# Altium project ModularPwrConv.PrjPcb
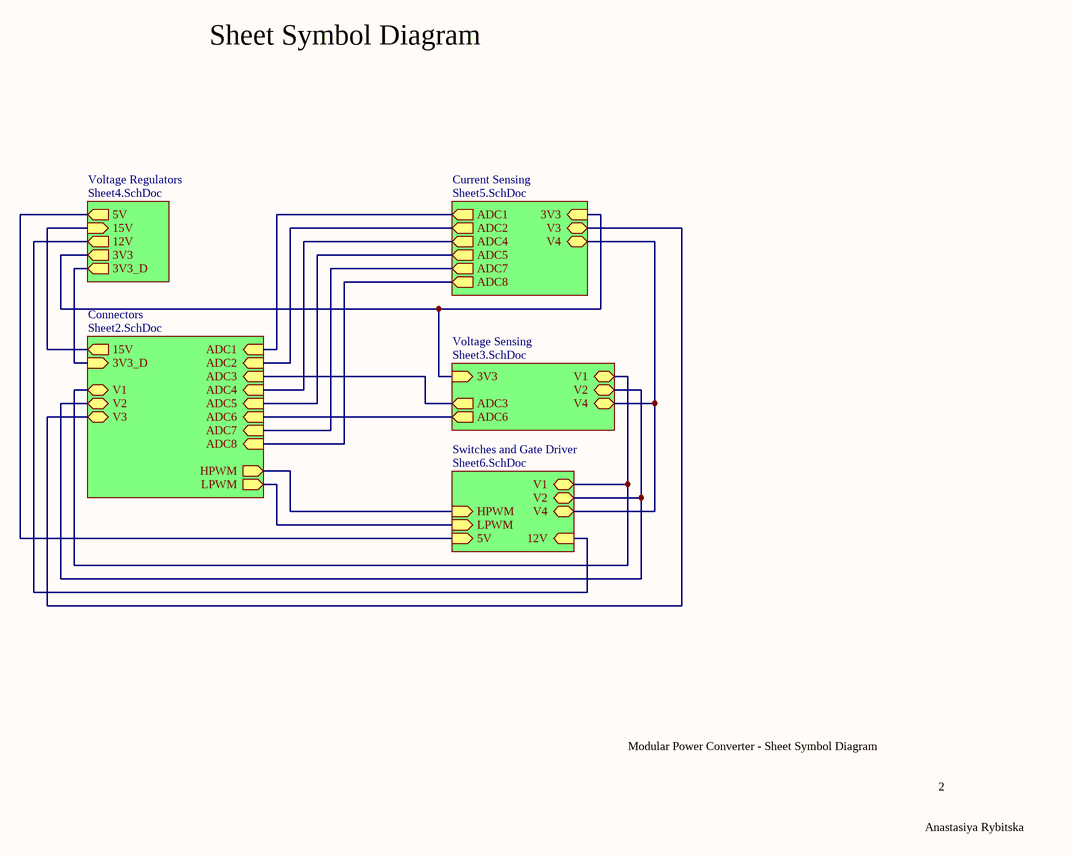
[diagram p0: Sheet1.SchDoc]
6 sheets, 147 parts. Net scope: hierarchical (ports join the sheet entries above them; power ports are global).
Board file: PCB1.PcbDoc
Sheets:
  Sheet1.SchDoc
    Connectors = Sheet2.SchDoc
    Voltage Sensing = Sheet3.SchDoc
    Voltage Regulators = Sheet4.SchDoc
    Current Sensing = Sheet5.SchDoc
    Switches and Gate Driver = Sheet6.SchDoc

## Sheet Sheet1.SchDoc
size A4; SheetNumber: 1; SheetTotal: 6

### Sub-sheets
Connectors = Sheet2.SchDoc: V1 (bidir), V2 (bidir), V3 (bidir), 15V (out), 3V3_D (in), ADC1 (in), ADC2 (in), ADC3 (in), ADC4 (in), ADC5 (in), ADC6 (in), ADC7 (in), ADC8 (in), HPWM (out), LPWM (out)
Current Sensing = Sheet5.SchDoc: V4 (bidir), V3 (bidir), ADC8 (out), ADC7 (out), ADC5 (out), ADC4 (out), ADC2 (out), ADC1 (out), 3V3 (in)
Switches and Gate Driver = Sheet6.SchDoc: V4 (bidir), V2 (bidir), 12V (in), HPWM (in), LPWM (in), V1 (bidir), 5V (in)
Voltage Regulators = Sheet4.SchDoc: 15V (in), 12V (out), 3V3 (out), 3V3_D (out), 5V (out)
Voltage Sensing = Sheet3.SchDoc: 3V3 (in), ADC3 (out), ADC6 (out), V1 (bidir), V2 (bidir), V4 (bidir)

### Nets
3V3: sheet Voltage Sensing/3V3, sheet Voltage Regulators/3V3, sheet Current Sensing/3V3
3V3_D: sheet Connectors/3V3_D, sheet Voltage Regulators/3V3_D
5V: sheet Voltage Regulators/5V, sheet Switches and Gate Driver/5V
12V: sheet Voltage Regulators/12V, sheet Switches and Gate Driver/12V
15V: sheet Connectors/15V, sheet Voltage Regulators/15V
ADC1: sheet Connectors/ADC1, sheet Current Sensing/ADC1
ADC2: sheet Connectors/ADC2, sheet Current Sensing/ADC2
ADC3: sheet Connectors/ADC3, sheet Voltage Sensing/ADC3
ADC4: sheet Connectors/ADC4, sheet Current Sensing/ADC4
ADC5: sheet Connectors/ADC5, sheet Current Sensing/ADC5
ADC6: sheet Connectors/ADC6, sheet Voltage Sensing/ADC6
ADC7: sheet Connectors/ADC7, sheet Current Sensing/ADC7
ADC8: sheet Connectors/ADC8, sheet Current Sensing/ADC8
HPWM: sheet Connectors/HPWM, sheet Switches and Gate Driver/HPWM
LPWM: sheet Connectors/LPWM, sheet Switches and Gate Driver/LPWM
V1: sheet Connectors/V1, sheet Voltage Sensing/V1, sheet Switches and Gate Driver/V1
V2: sheet Connectors/V2, sheet Voltage Sensing/V2, sheet Switches and Gate Driver/V2
V3: sheet Connectors/V3, sheet Current Sensing/V3
V4: sheet Voltage Sensing/V4, sheet Current Sensing/V4, sheet Switches and Gate Driver/V4

### Notes on the sheet
- Sheet Symbol Diagram
- Modular Power Converter - Sheet Symbol Diagram
- 2
- Anastasiya Rybitska

## Sheet Sheet2.SchDoc
size A4; SheetNumber: 2; SheetTotal: 6
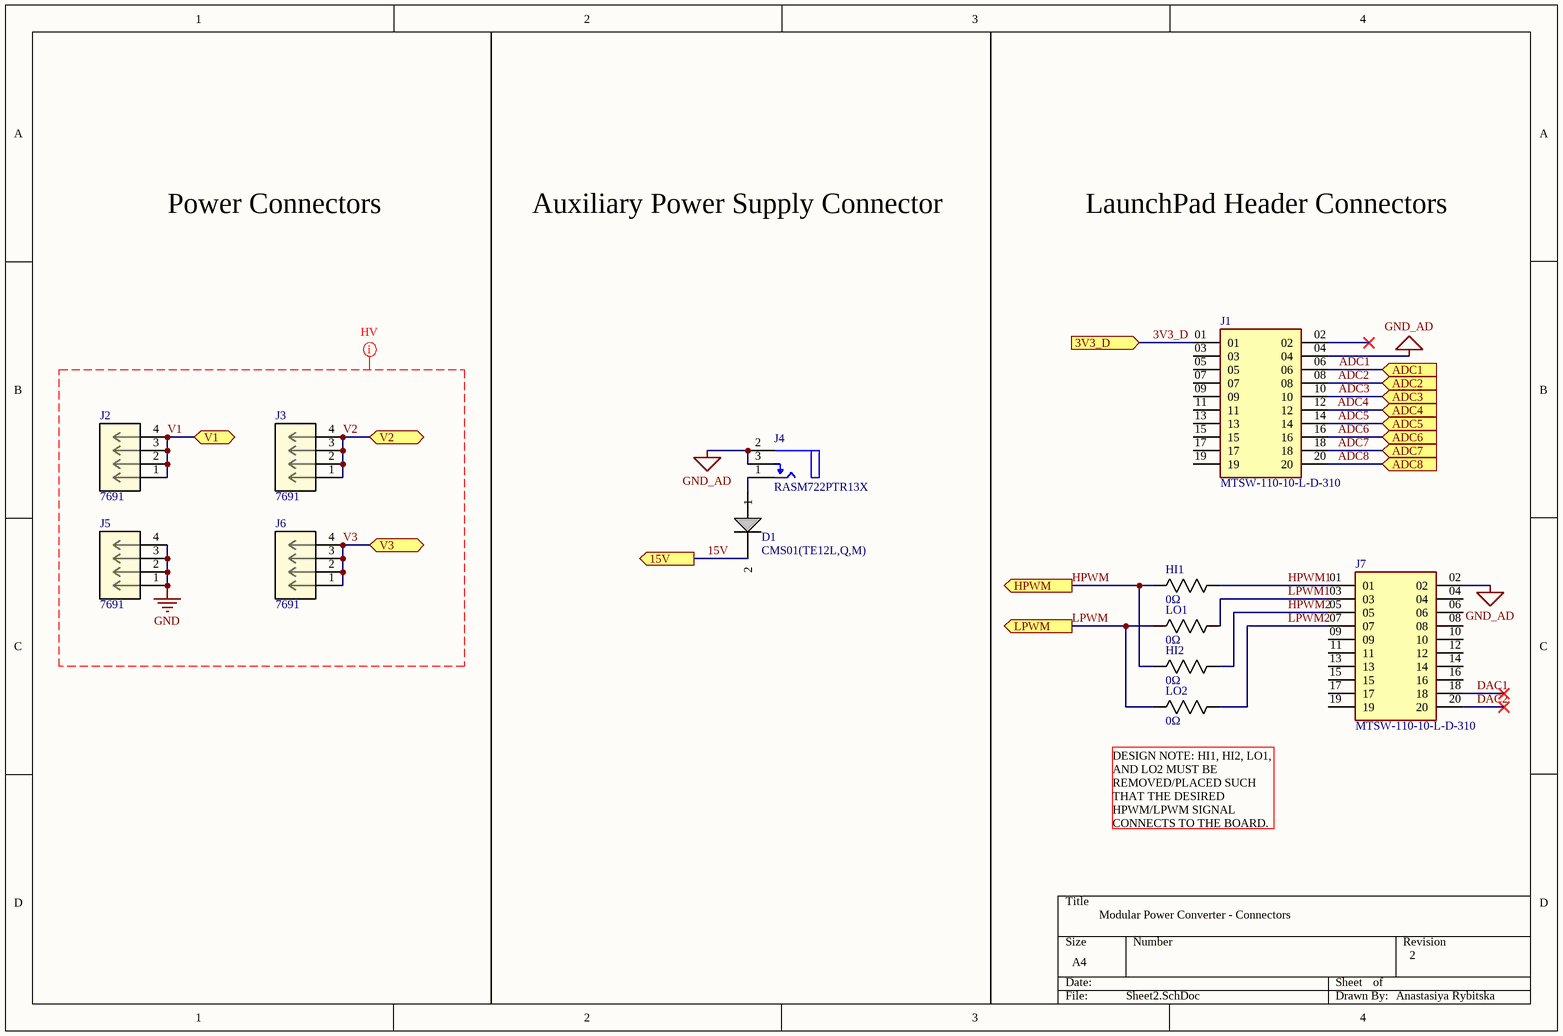
[diagram p1: Sheet2.SchDoc]

### Parts
D1  CMS01(TE12L,Q,M)  [M-FLAT_TOS]
HI1  Resistance: 0Ω  [0603]  (hidden comment: AC0603FR-070RL)
HI2  Resistance: 0Ω  [0603]  (hidden comment: AC0603FR-070RL)
J1  MTSW-110-10-L-D-310  [SAMTEC_MTSW-110-10-L-D-310]
J2  7691  [CONN_8191_KEY]
J3  7691  [CONN_8191_KEY]
J4  RASM722PTR13X  [FP-RASM722PTR13X-MFG]
J5  7691  [CONN_8191_KEY]
J6  7691  [CONN_8191_KEY]
J7  MTSW-110-10-L-D-310  [SAMTEC_MTSW-110-10-L-D-310]
LO1  Resistance: 0Ω  [0603]  (hidden comment: AC0603FR-070RL)
LO2  Resistance: 0Ω  [0603]  (hidden comment: AC0603FR-070RL)

### Ports
3V3_D (in), 15V (out), ADC1 (in), ADC2 (in), ADC3 (in), ADC4 (in), ADC5 (in), ADC6 (in), ADC7 (in), ADC8 (in), HPWM (out), LPWM (out), V1 (bidir), V2 (bidir), V3 (bidir)

### Nets
GND: J5.1 J5.2 J5.3 J5.4
GND_AD: J1.04 J4.2(SLEEVE_TERMINAL) J4.3(SHUNT_TERMINAL) J7.02
3V3_D: J1.01 ; port 3V3_D
15V: D1.2 ; port 15V
ADC1: J1.06 ; port ADC1
ADC2: J1.08 ; port ADC2
ADC3: J1.10 ; port ADC3
ADC4: J1.12 ; port ADC4
ADC5: J1.14 ; port ADC5
ADC6: J1.16 ; port ADC6
ADC7: J1.18 ; port ADC7
ADC8: J1.20 ; port ADC8
DAC1: J7.18
DAC2: J7.20
HPWM: HI1.1 HI2.1 ; port HPWM
HPWM1: HI1.2 J7.01
HPWM2: HI2.2 J7.05
LPWM: LO1.1 LO2.1 ; port LPWM
LPWM1: J7.03 LO1.2
LPWM2: J7.07 LO2.2
V1: J2.1 J2.2 J2.3 J2.4 ; port V1
V2: J3.1 J3.2 J3.3 J3.4 ; port V2
V3: J6.1 J6.2 J6.3 J6.4 ; port V3
NetD1_1: D1.1 J4.1(TIP_TERMINAL(CENTER_PIN))

Not connected (* = marked no-connect by the designer): J1 02* 03 05 07 09 11 13 15 17 19; J7 04 06 08 09 10 11 12 13 14 15 16 17 19

### Layout directives
rule Clearance Constraint [Clearance = 0.6mm]: GND, V1, V2, V3

### Notes on the sheet
- Power Connectors
- Auxiliary Power Supply Connector
- LaunchPad Header Connectors
- (near LO2) DESIGN NOTE: HI1, HI2, LO1, AND LO2 MUST BE REMOVED/PLACED SUCH THAT THE DESIRED HPWM/LPWM SIGNAL CONNECTS TO THE BOARD.
- Modular Power Converter - Connectors
- 2
- Anastasiya Rybitska

### Library data of the parts
D1 = CMS01(TE12L,Q,M): No Description Available; Mfr_Name: Toshiba Electronic Devices & Storage Co.; Type: DEV; Number_devices_in_Package: 1; Copyright: Copyright (C) 2022 Ultra Librarian. All rights reserved.; Manufacturer_Part_Number: CMS01(TE12L,Q,M); Digi-Key_Part_Number_1: CMS01QTR-ND; Digi-Key_Part_Number_2: CMS01QCT-ND; Digi-Key_Part_Number_3: CMS01QDKR-ND; RefDes: RefDes; Source_Package: CMS01
HI1 HI2 LO1 LO2 = AC0603FR-070RL: RES SMD 0 OHM JUMPER 1/10W 0603
J2 J3 J5 J6 = 7691: TERM SCREW 6-32 4 PIN PCB; Mfr_Name: Keystone Electronics; Copyright: Copyright (C) 2022 Ultra Librarian. All rights reserved.; Manufacturer_Part_Number: 7691; Digi-Key_Part_Number_1: 36-8191-ND; Digi-Key_Part_Number_2: 8191K-ND; Digi-Key_Part_Number_3: 36-8191-NDL; RefDes: RefDes; Type: DEV
J4 = CMP-47995-000002-1: CONN PWR JACK 2.1X5.5MM SOLDER; Shielding: Unshielded; Gender: Male; Current Rating: 5A; Termination: Solder; Contact Material: Copper Alloy; Package Quantity: 120; Case/Package: SMD/SMT; Contact Plating: Tin; Connector Type: Jack; Housing Material: Thermoplastic; Mount: Surface Mount; Housing Color: Black; Color: Black
J1 J7 = MTSW-110-10-L-D-310: Package: None; Price: None; Value: *; MP: MTSW-110-10-L-D-310; Availability: Unavailable

## Sheet Sheet3.SchDoc
size A4; SheetNumber: 3; SheetTotal: 6
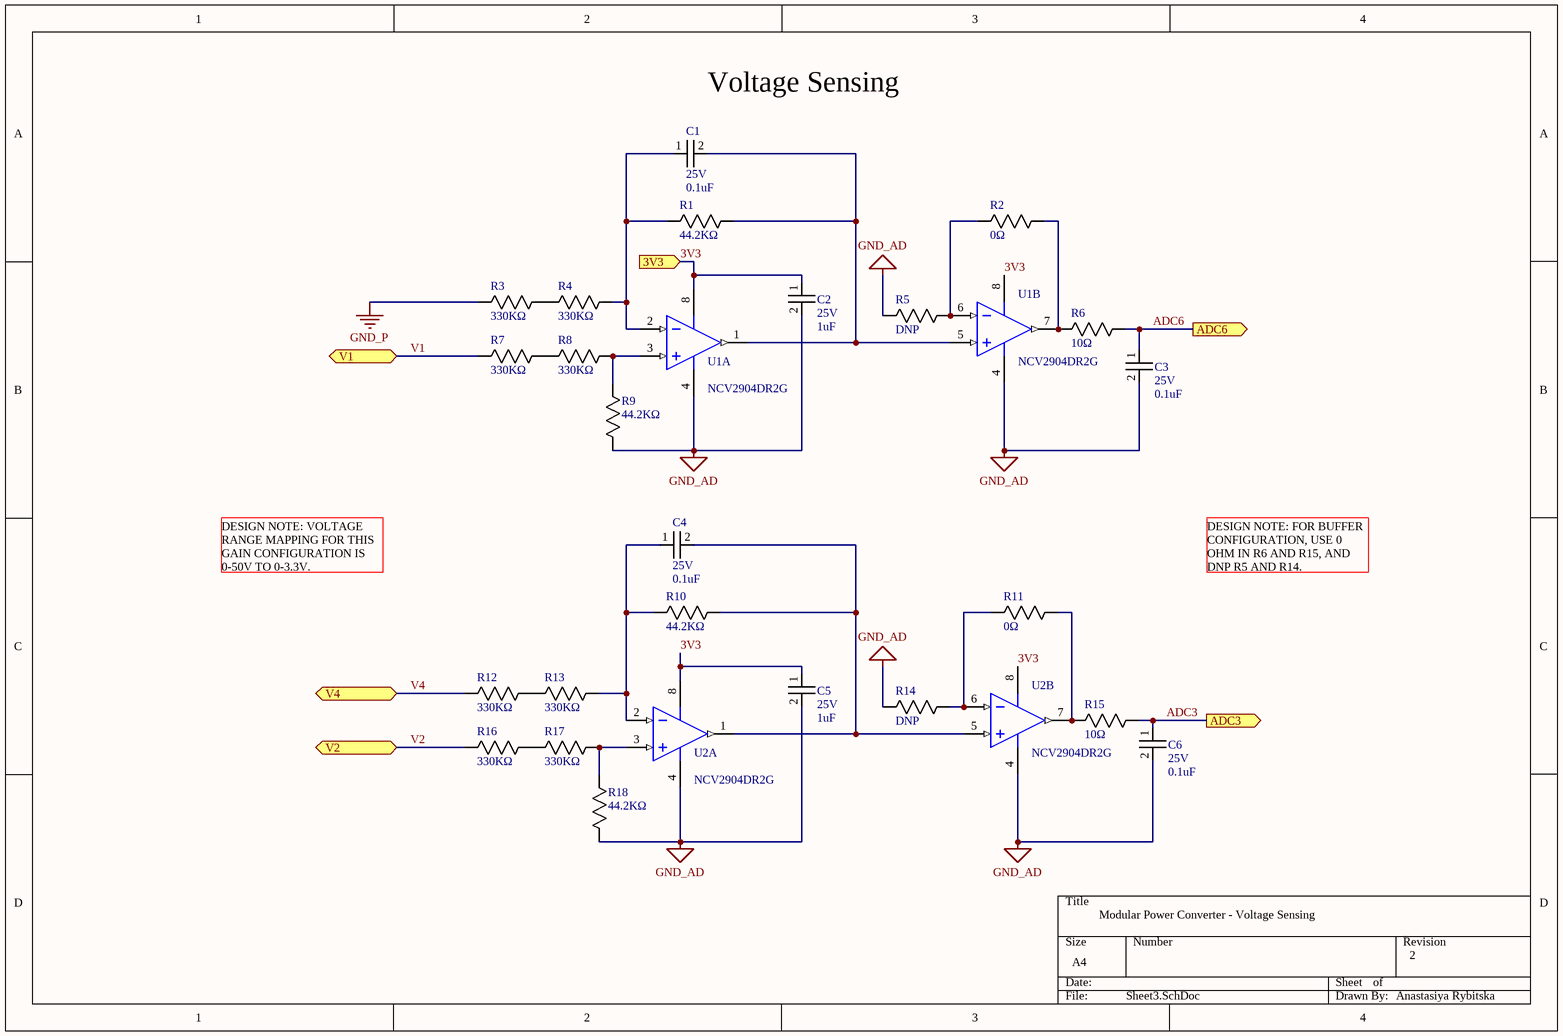
[diagram p2: Sheet3.SchDoc]

### Parts
C1  Voltage Rating: 25V  Capacitance: 0.1uF  [0603]  (hidden comment: CC0603MRX7R8BB104)
C2  Voltage Rating: 25V  Capacitance: 1uF  [0603]  (hidden comment: CL10B105KA8NFNC)
C3  Voltage Rating: 25V  Capacitance: 0.1uF  [0603]  (hidden comment: CC0603MRX7R8BB104)
C4  Voltage Rating: 25V  Capacitance: 0.1uF  [0603]  (hidden comment: CC0603MRX7R8BB104)
C5  Voltage Rating: 25V  Capacitance: 1uF  [0603]  (hidden comment: CL10B105KA8NFNC)
C6  Voltage Rating: 25V  Capacitance: 0.1uF  [0603]  (hidden comment: CC0603MRX7R8BB104)
R1  Resistance: 44.2KΩ  [0603]  (hidden comment: RT0603FRE0744K2L)
R2  Resistance: 0Ω  [0603]  (hidden comment: AC0603FR-070RL)
R3  Resistance: 330KΩ  [0603]  (hidden comment: ERJ3EKF3303V)
R4  Resistance: 330KΩ  [0603]  (hidden comment: ERJ3EKF3303V)
R5  Resistance: DNP  [0603]  (hidden comment: AC0603FR-070RL)
R6  Resistance: 10Ω  [0603]  (hidden comment: RMCF0603JT10R0)
R7  Resistance: 330KΩ  [0603]  (hidden comment: ERJ3EKF3303V)
R8  Resistance: 330KΩ  [0603]  (hidden comment: ERJ3EKF3303V)
R9  Resistance: 44.2KΩ  [0603]  (hidden comment: RT0603FRE0744K2L)
R10  Resistance: 44.2KΩ  [0603]  (hidden comment: RT0603FRE0744K2L)
R11  Resistance: 0Ω  [0603]  (hidden comment: AC0603FR-070RL)
R12  Resistance: 330KΩ  [0603]  (hidden comment: ERJ3EKF3303V)
R13  Resistance: 330KΩ  [0603]  (hidden comment: ERJ3EKF3303V)
R14  Resistance: DNP  [0603]  (hidden comment: AC0603FR-070RL)
R15  Resistance: 10Ω  [0603]  (hidden comment: RMCF0603JT10R0)
R16  Resistance: 330KΩ  [0603]  (hidden comment: ERJ3EKF3303V)
R17  Resistance: 330KΩ  [0603]  (hidden comment: ERJ3EKF3303V)
R18  Resistance: 44.2KΩ  [0603]  (hidden comment: RT0603FRE0744K2L)
U1  NCV2904DR2G  [ONSC-SOIC-8-751-07_V]  (parts A,B of 2)
U2  NCV2904DR2G  [ONSC-SOIC-8-751-07_V]  (parts A,B of 2)

### Ports
3V3 (in), ADC3 (out), ADC6 (out), V1 (bidir), V2 (bidir), V4 (bidir)

### Nets
GND_AD: C2.2 C3.2 C5.2 C6.2 R5.1 R9.1 R14.1 R18.1 U1.4(VEE/GND) U2.4(VEE/GND)
GND_P: R3.1
3V3: C2.1 C5.1 U1.8(VCC) U2.8(VCC) ; port 3V3
ADC3: C6.1 R15.2 ; port ADC3
ADC6: C3.1 R6.2 ; port ADC6
V1: R7.1 ; port V1
V2: R16.1 ; port V2
V4: R12.1 ; port V4
NetC1_1: C1.1 R1.1 R4.2 U1.2(INA-)
NetC1_2: C1.2 R1.2 U1.1(OUTA) U1.5(INB+)
NetC4_1: C4.1 R10.1 R13.2 U2.2(INA-)
NetC4_2: C4.2 R10.2 U2.1(OUTA) U2.5(INB+)
NetR2_1: R2.1 R5.2 U1.6(INB-)
NetR2_2: R2.2 R6.1 U1.7(OUTB)
NetR3_2: R3.2 R4.1
NetR7_2: R7.2 R8.1
NetR8_2: R8.2 R9.2 U1.3(INA+)
NetR11_1: R11.1 R14.2 U2.6(INB-)
NetR11_2: R11.2 R15.1 U2.7(OUTB)
NetR12_2: R12.2 R13.1
NetR16_2: R16.2 R17.1
NetR17_2: R17.2 R18.2 U2.3(INA+)

### Notes on the sheet
- Voltage Sensing
- DESIGN NOTE: VOLTAGE RANGE MAPPING FOR THIS GAIN CONFIGURATION IS 0-50V TO 0-3.3V.
- DESIGN NOTE: FOR BUFFER CONFIGURATION, USE 0 OHM IN R6 AND R15, AND DNP R5 AND R14.
- Modular Power Converter - Voltage Sensing
- 2
- Anastasiya Rybitska

### Library data of the parts
C1 C3 C4 C6 = CC0603MRX7R8BB104: CAP CER 0.1UF 25V X7R 0603
C2 C5 = CL10B105KA8NFNC: Cap Ceramic 1uF 25V X7R ±10% Pad SMD 0603 +125°C T/R
R1 R9 R10 R18 = RT0603FRE0744K2L: RES SMD 44.2K OHM 1% 1/10W 0603
R2 R5 R11 R14 = AC0603FR-070RL: RES SMD 0 OHM JUMPER 1/10W 0603
R6 R15 = RMCF0603JT10R0: RES 10 OHM 5% 1/10W 0603
U1 U2 = CMP-1310-00228-1: Single Supply Dual Operational Amplifier, 3 to 32 V, -40 to 125 degC, 8-Pin SOIC, Pb-Free, Tape and Reel; Manufacturer: On Semiconductor; VCC Min (V): 3; VCC Max (V): 32; DatasheetVersion: Rev. 27; ComponentLink2URL: http://www.onsemi.cn/pub_link/Collateral/LM358-D.PDF; Mounting Technology: Surface Mount; PackageReference: SOIC-8-751-07; PartNumber: NCV2904DR2G; ComponentLink1Description: Manufacturer URL; ComponentLink2Description: Datasheet; ComponentLink3Description: Package Specification; RoHS: TRUE; PackageDescription: 8-Pin Small Outline Integrated Circuit, Body 4.9 x 3.9 mm, Pitch 1.27 mm; ComponentLink3URL: http://www.onsemi.com/pub_link/Collateral/751-07.PDF; PackageVersion: Rev. AK, 02/2011; ComponentLink1URL: http://www.onsemi.com/; Packing: Tape and Reel

## Sheet Sheet4.SchDoc
size A4; SheetNumber: 4; SheetTotal: 6
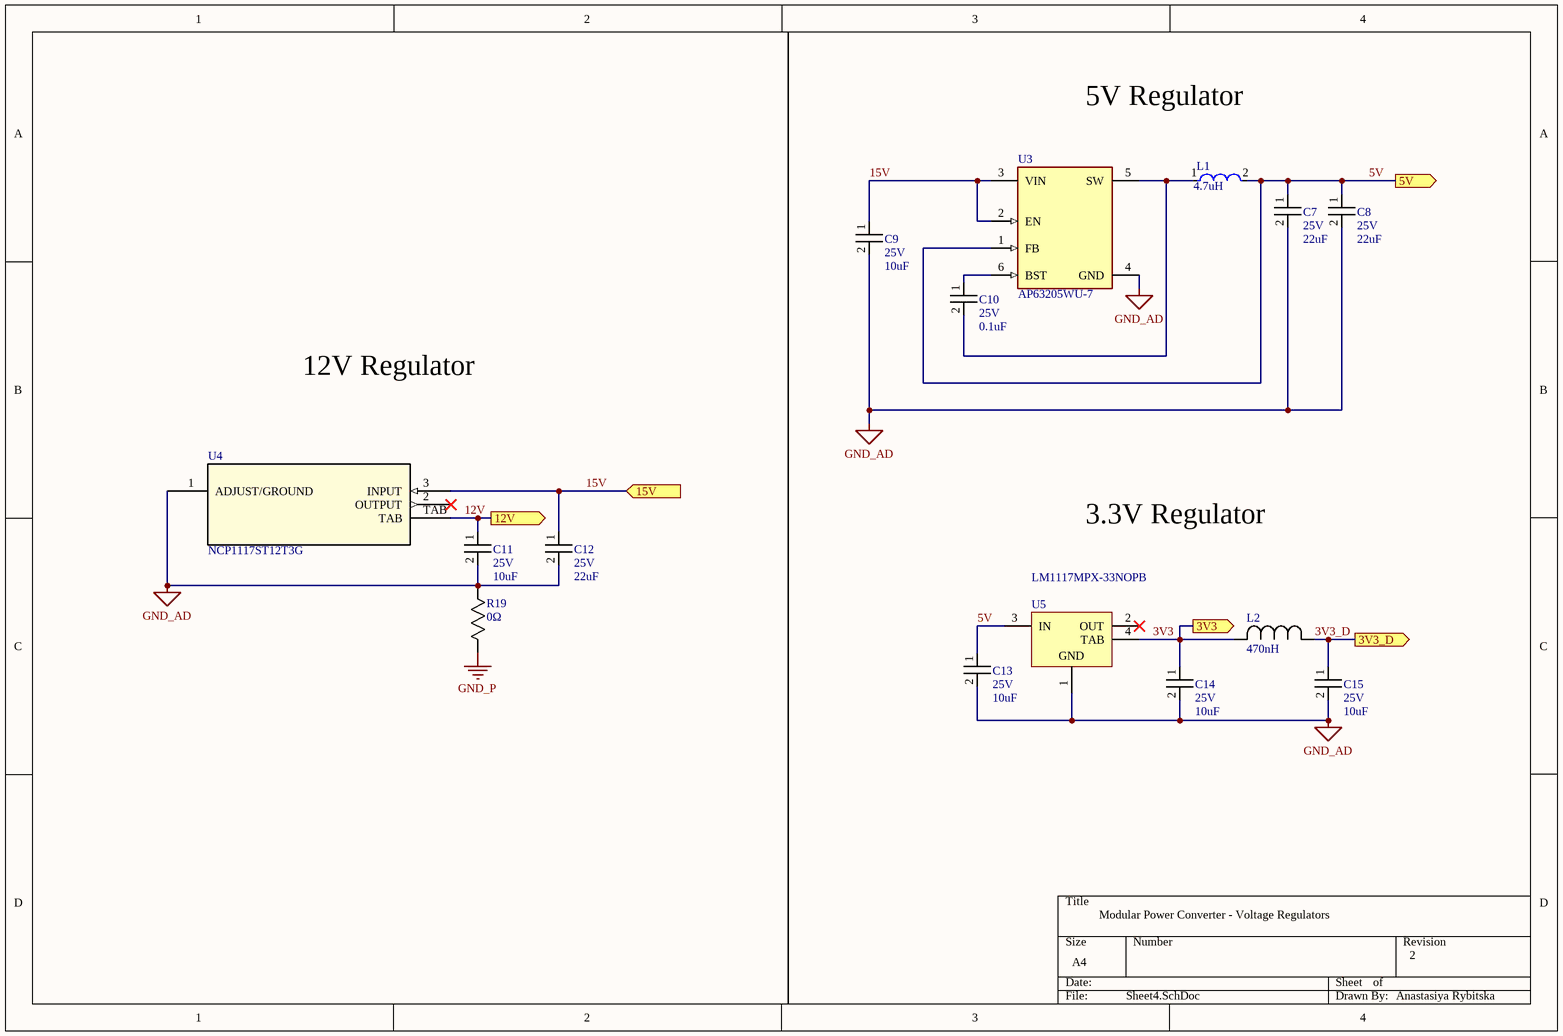
[diagram p3: Sheet4.SchDoc]

### Parts
C7  Voltage Rating: 25V  Capacitance: 22uF  [0805]  (hidden comment: CL21A226MAYNNNE)
C8  Voltage Rating: 25V  Capacitance: 22uF  [0805]  (hidden comment: CL21A226MAYNNNE)
C9  Voltage Rating: 25V  Capacitance: 10uF  [0805]  (hidden comment: TMK212BBJ106KG-T)
C10  Voltage Rating: 25V  Capacitance: 0.1uF  [0603]  (hidden comment: CC0603MRX7R8BB104)
C11  Voltage Rating: 25V  Capacitance: 10uF  [0805]  (hidden comment: TMK212BBJ106KG-T)
C12  Voltage Rating: 25V  Capacitance: 22uF  [0805]  (hidden comment: CL21A226MAYNNNE)
C13  Voltage Rating: 25V  Capacitance: 10uF  [0805]  (hidden comment: TMK212BBJ106KG-T)
C14  Voltage Rating: 25V  Capacitance: 10uF  [0805]  (hidden comment: TMK212BBJ106KG-T)
C15  Voltage Rating: 25V  Capacitance: 10uF  [0805]  (hidden comment: TMK212BBJ106KG-T)
L1  Inductance: 4.7uH  [FP-MLZ2012-0_85-IPC_B]  (hidden comment: MLZ2012M4R7WT000)
L2  Inductance: 470nH  [0805]  (hidden comment: MLZ2012DR47DT000)
R19  Resistance: 0Ω  [0603]  (hidden comment: AC0603FR-070RL)
U3  AP63205WU-7  [FP-TSOT26-MFG]
U4  NCP1117ST12T3G  [SOT223-3_ONS]
U5  LM1117MPX-33NOPB  [DCY0004A_L]

### Ports
3V3 (out), 3V3_D (out), 5V (out), 12V (out), 15V (in)

### Nets
GND_AD: C7.2 C8.2 C9.2 C11.2 C12.2 C13.2 C14.2 C15.2 R19.1 U3.4(GND) U4.1(ADJUST/GROUND) U5.1(GND)
GND_P: R19.2
3V3: C14.1 L2.2 U5.4(TAB) ; port 3V3
3V3_D: C15.1 L2.1 ; port 3V3_D
5V: C7.1 C8.1 C13.1 L1.2 U3.1(FB) U5.3(IN) ; port 5V
12V: C11.1 U4.TAB ; port 12V
15V: C9.1 C12.1 U3.2(EN) U3.3(VIN) U4.3(INPUT) ; port 15V
NetC10_1: C10.1 U3.6(BST)
NetC10_2: C10.2 L1.1 U3.5(SW)

Not connected (* = marked no-connect by the designer): U4 2(OUTPUT)*; U5 2(OUT)*

### Notes on the sheet
- 5V Regulator
- 12V Regulator
- 3.3V Regulator
- Modular Power Converter - Voltage Regulators
- 2
- Anastasiya Rybitska

### Library data of the parts
C7 C8 C12 = TMK212BBJ106KG-T: 22 µF ±20% 25V Ceramic Capacitor X5R 0805 (2012 Metric)
C9 C11 C13-C15 = TMK212BBJ106KG-T: Multilayer Ceramic Capacitor 10uF 25V X5R 10% SMD 0805 T/R
C10 = CC0603MRX7R8BB104: CAP CER 0.1UF 25V X7R 0603
L1 = CMP-08253-000349-1: Shielded Multilayer Inductor 4.7uH ±20% 500mA 390mΩ SMD 0805; Self Resonant Frequency: 70MHz; Saturation Current: 180mA; Test Frequency: 2MHz; Core Material: Ferrite; DC Resistance (DCR): 390mR; Current Rating: 500mA; Length: 0.079inch; Case Code (Imperial): 0805; Mount: Surface Mount; Max Operating Temperature: 125°C; RoHS Compliant: Yes; Case Code (Metric): 2012; Lead Free: Lead Free; Height - Seated (Max): 0.041inch; Shielding: Shielded; Packaging: Tape and Reel; Package Quantity: 1; Min Operating Temperature: -55°C; Case/Package: 0805; Tolerance: 20%; Width: 0.049inch
L2 = MLZ2012DR47DT000: Shielded Multilayer Inductor 470nH ±20% 700mA 234mΩ SMD 0805
R19 = AC0603FR-070RL: RES SMD 0 OHM JUMPER 1/10W 0603
U3 = CMP-12757-000001-1: IC REG BUCK 5V 2A TSOT26; Manufacturer: Diodes Inc.; Max Junction Temp: +160°C; Max Duty Cycle: 100%; Standoff Height: 0.01mm; Max Supply Voltage: 32V; Number Of Outputs: 1; Min Supply Voltage: 3.8V; Output Type: Fixed; Switching Frequency: 1100kHz; Nominal Supply Current: 22uA; Automotive: No; RoHS: TRUE; Switching Topology: Buck; Temperature: -40°C to +85°C; Footprint Url: https://www.diodes.com/assets/Package-Files/TSOT26.pdf; Lead Free: Yes; Digikey Description: IC REG BUCK 5V 2A TSOT26; Device Class L3: Voltage Regulators - Switching; Ambient Temperature Range High: +85°C; Category: IC; Package: TSOT26; Output Voltage: 5V; Output Current: 2A; ComponentLink2Description: Datasheet; Device Class L2: Power Management ICs; Ambient Temperature Range Low: -40°C; Temperature Range High: +85°C; Temperature Range Low: -40°C; Octopart: https://octopart.com/ap63205wu-7-diodes+inc.-98099551; Manufacturer Part Number: AP63205WU-7; Height: 1mm; Device Class L1: Integrated Circuits (ICs); ComponentLink2URL: https://www.diodes.com/assets/Datasheets/AP63200-AP63201-AP63203-AP63205.pdf
U4 = NCP1117ST12T3G: No Description Available; Mfr_Name: onsemi; Copyright: Copyright (C) 2022 Ultra Librarian. All rights reserved.; Manufacturer_Part_Number: NCP1117ST12T3G; Digi-Key_Part_Number_1: 2156-NCP1117ST12T3G-OS-ND; Digi-Key_Part_Number_2: =NCP1117ST12T3G; Digi-Key_Part_Number_3: NCP1117ST12T3GOSCT-ND; Digi-Key_Part_Number_4: NCP1117ST12T3GOSDKR-ND; Digi-Key_Part_Number_5: NCP1117ST12T3GOSTR-ND; RefDes: RefDes; Type: DEV
U5 = CMP-0062-01639-4: IC REG LINEAR 3.3V 800MA SOT223; Manufacturer: onsemi; High-Reliability: Y; PowerWise: N; PackageTopMarking: XYTT*N05A; CompType: LDO IC; ComponentLink1URL: http://www.ti.com/general/docs/lit/getliterature.tsp?genericPartNumber=LM1117-N&fileType=pdf; PartNumber: LM1117MPX-33NOPB; ComponentLink1Description: Datasheet URL; PinCount: 4; Code_JEDEC: TO-261-AA; PackageDescription: Molded SOT-223, 6.50 x 3.56 x 1.6mm Body, 4 Lead, 2.3mm Pitch; PackageReference: DCY0004A; RoHS: Y; Code_IPC: SOT223-4

## Sheet Sheet5.SchDoc
size A3; SheetNumber: 5; SheetTotal: 6
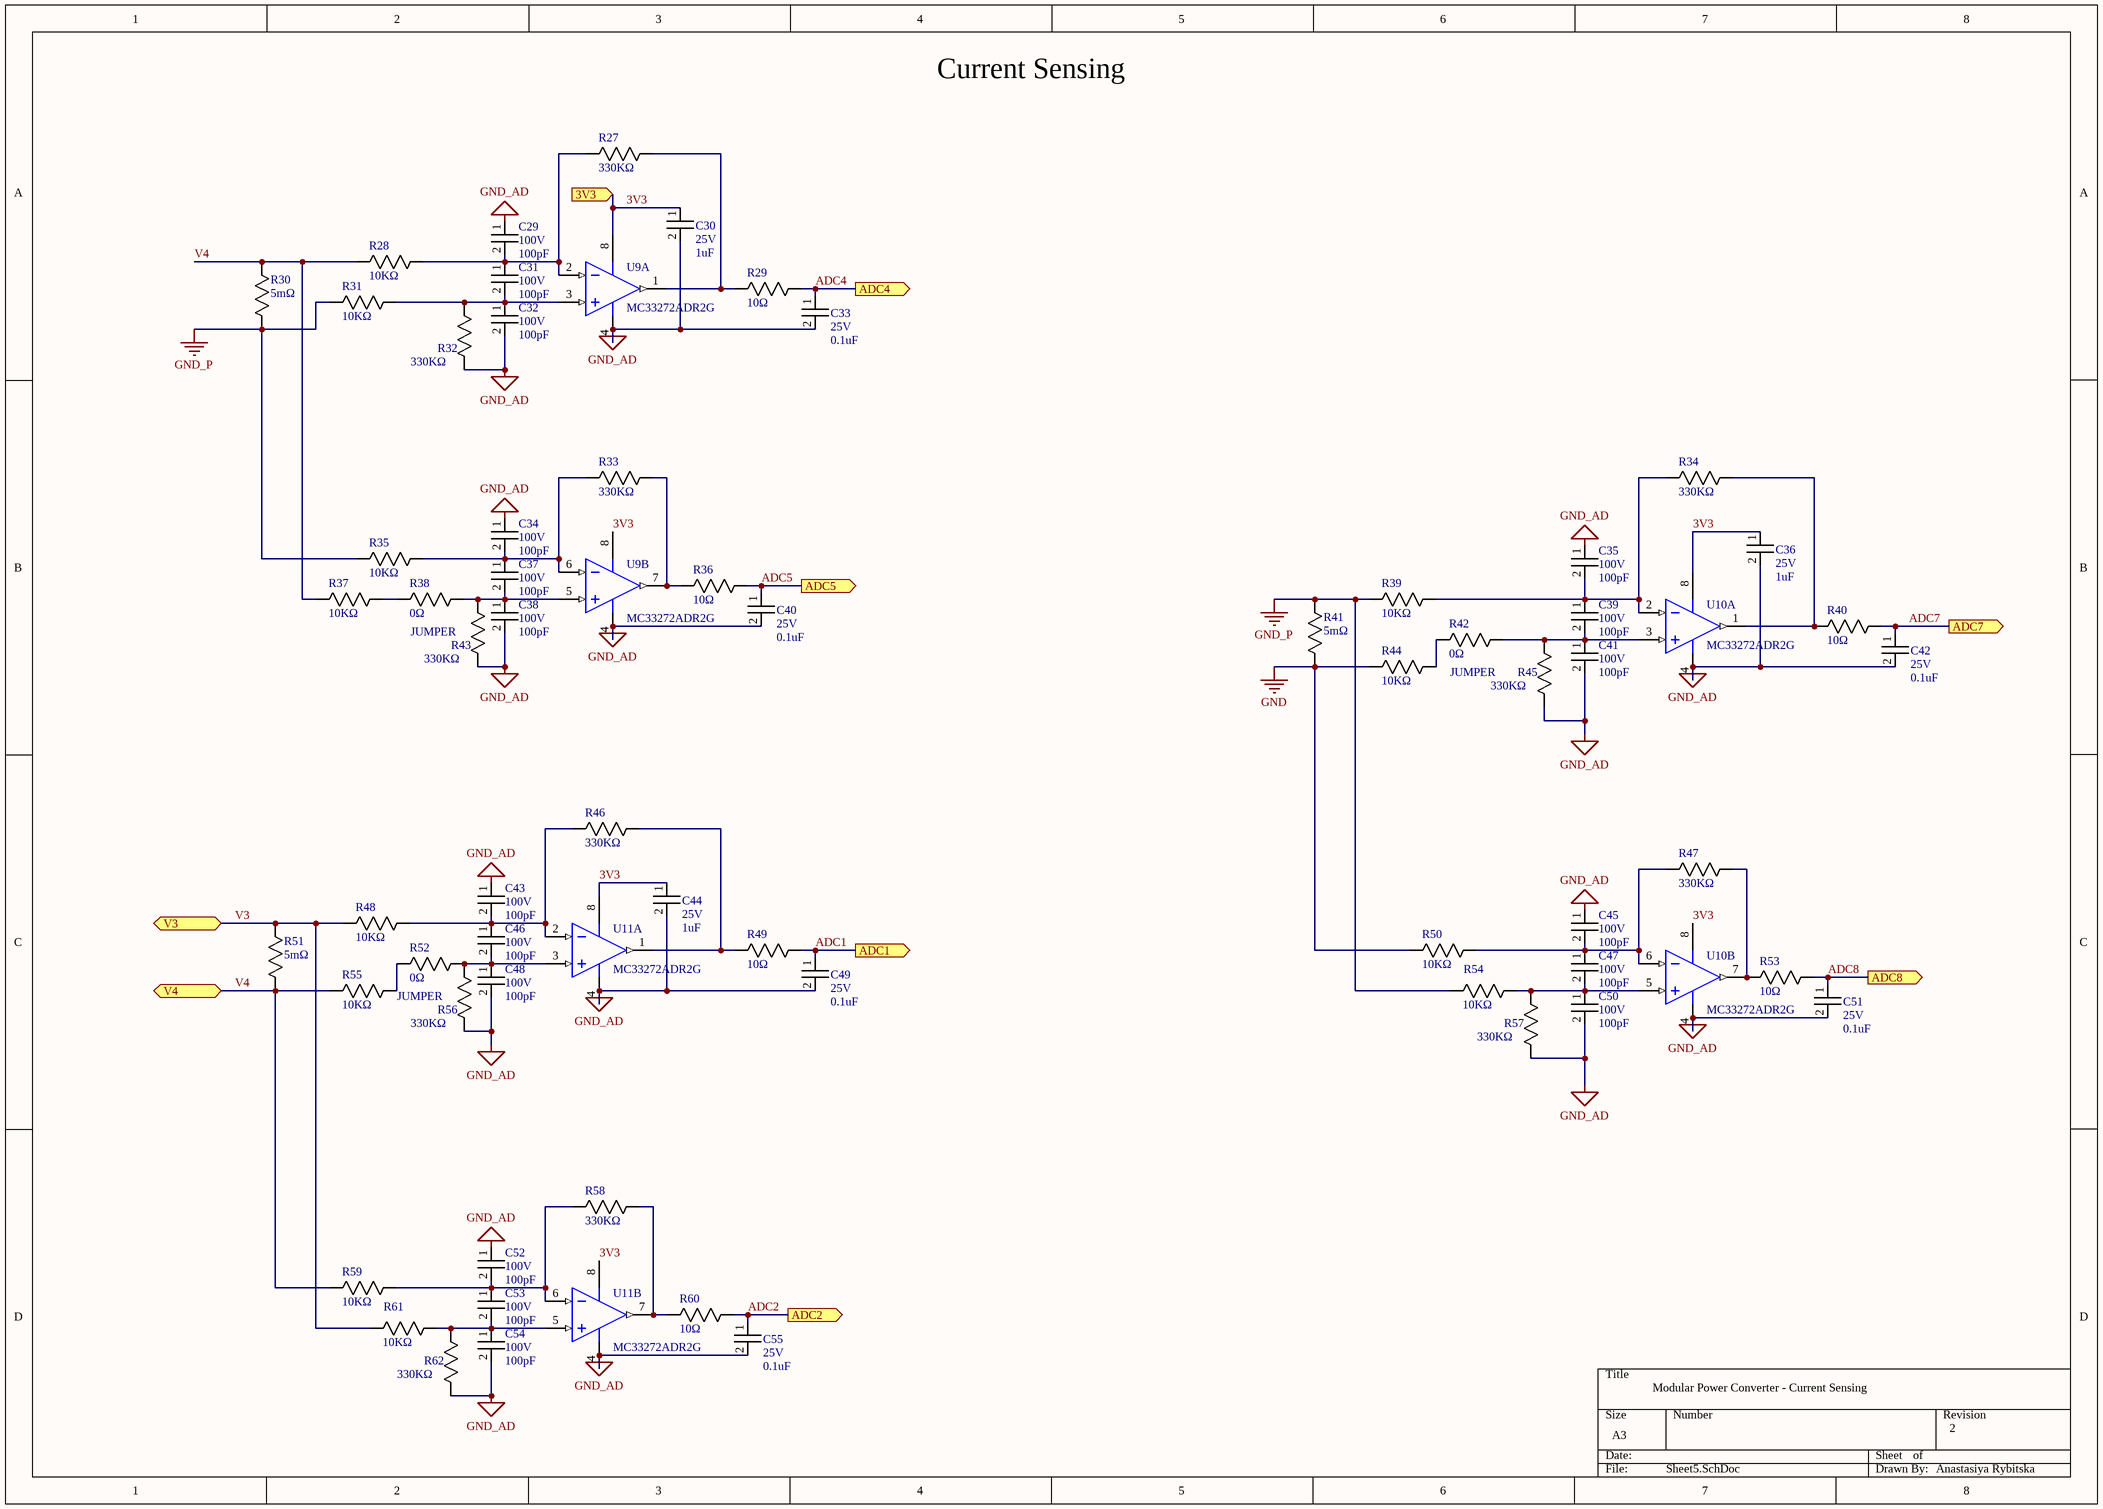
[diagram p4: Sheet5.SchDoc]

### Parts
C29  Voltage Rating: 100V  Capacitance: 100pF  [0603]  (hidden comment: 06031C101KAT2A)
C30  Voltage Rating: 25V  Capacitance: 1uF  [0603]  (hidden comment: CL10B105KA8NFNC)
C31  Voltage Rating: 100V  Capacitance: 100pF  [0603]  (hidden comment: 06031C101KAT2A)
C32  Voltage Rating: 100V  Capacitance: 100pF  [0603]  (hidden comment: 06031C101KAT2A)
C33  Voltage Rating: 25V  Capacitance: 0.1uF  [0603]  (hidden comment: CC0603MRX7R8BB104)
C34  Voltage Rating: 100V  Capacitance: 100pF  [0603]  (hidden comment: 06031C101KAT2A)
C35  Voltage Rating: 100V  Capacitance: 100pF  [0603]  (hidden comment: 06031C101KAT2A)
C36  Voltage Rating: 25V  Capacitance: 1uF  [0603]  (hidden comment: CL10B105KA8NFNC)
C37  Voltage Rating: 100V  Capacitance: 100pF  [0603]  (hidden comment: 06031C101KAT2A)
C38  Voltage Rating: 100V  Capacitance: 100pF  [0603]  (hidden comment: 06031C101KAT2A)
C39  Voltage Rating: 100V  Capacitance: 100pF  [0603]  (hidden comment: 06031C101KAT2A)
C40  Voltage Rating: 25V  Capacitance: 0.1uF  [0603]  (hidden comment: CC0603MRX7R8BB104)
C41  Voltage Rating: 100V  Capacitance: 100pF  [0603]  (hidden comment: 06031C101KAT2A)
C42  Voltage Rating: 25V  Capacitance: 0.1uF  [0603]  (hidden comment: CC0603MRX7R8BB104)
C43  Voltage Rating: 100V  Capacitance: 100pF  [0603]  (hidden comment: 06031C101KAT2A)
C44  Voltage Rating: 25V  Capacitance: 1uF  [0603]  (hidden comment: CL10B105KA8NFNC)
C45  Voltage Rating: 100V  Capacitance: 100pF  [0603]  (hidden comment: 06031C101KAT2A)
C46  Voltage Rating: 100V  Capacitance: 100pF  [0603]  (hidden comment: 06031C101KAT2A)
C47  Voltage Rating: 100V  Capacitance: 100pF  [0603]  (hidden comment: 06031C101KAT2A)
C48  Voltage Rating: 100V  Capacitance: 100pF  [0603]  (hidden comment: 06031C101KAT2A)
C49  Voltage Rating: 25V  Capacitance: 0.1uF  [0603]  (hidden comment: CC0603MRX7R8BB104)
C50  Voltage Rating: 100V  Capacitance: 100pF  [0603]  (hidden comment: 06031C101KAT2A)
C51  Voltage Rating: 25V  Capacitance: 0.1uF  [0603]  (hidden comment: CC0603MRX7R8BB104)
C52  Voltage Rating: 100V  Capacitance: 100pF  [0603]  (hidden comment: 06031C101KAT2A)
C53  Voltage Rating: 100V  Capacitance: 100pF  [0603]  (hidden comment: 06031C101KAT2A)
C54  Voltage Rating: 100V  Capacitance: 100pF  [0603]  (hidden comment: 06031C101KAT2A)
C55  Voltage Rating: 25V  Capacitance: 0.1uF  [0603]  (hidden comment: CC0603MRX7R8BB104)
R27  Resistance: 330KΩ  [0603]  (hidden comment: ERJ3EKF3303V)
R28  Resistance: 10KΩ  [0603]  (hidden comment: RNCP0603FTD10K0)
R29  Resistance: 10Ω  [0603]  (hidden comment: RMCF0603JT10R0)
R30  Resistance: 5mΩ  [RES_LVT12_004-020_OHM]  (hidden comment: LVT12R0050FER)
R31  Resistance: 10KΩ  [0603]  (hidden comment: RNCP0603FTD10K0)
R32  Resistance: 330KΩ  [0603]  (hidden comment: ERJ3EKF3303V)
R33  Resistance: 330KΩ  [0603]  (hidden comment: ERJ3EKF3303V)
R34  Resistance: 330KΩ  [0603]  (hidden comment: ERJ3EKF3303V)
R35  Resistance: 10KΩ  [0603]  (hidden comment: RNCP0603FTD10K0)
R36  Resistance: 10Ω  [0603]  (hidden comment: RMCF0603JT10R0)
R37  Resistance: 10KΩ  [0603]  (hidden comment: RNCP0603FTD10K0)
R38  Resistance: 0Ω  [0603]  (hidden comment: AC0603FR-070RL)
R39  Resistance: 10KΩ  [0603]  (hidden comment: RNCP0603FTD10K0)
R40  Resistance: 10Ω  [0603]  (hidden comment: RMCF0603JT10R0)
R41  Resistance: 5mΩ  [RES_LVT12_004-020_OHM]  (hidden comment: LVT12R0050FER)
R42  Resistance: 0Ω  [0603]  (hidden comment: AC0603FR-070RL)
R43  Resistance: 330KΩ  [0603]  (hidden comment: ERJ3EKF3303V)
R44  Resistance: 10KΩ  [0603]  (hidden comment: RNCP0603FTD10K0)
R45  Resistance: 330KΩ  [0603]  (hidden comment: ERJ3EKF3303V)
R46  Resistance: 330KΩ  [0603]  (hidden comment: ERJ3EKF3303V)
R47  Resistance: 330KΩ  [0603]  (hidden comment: ERJ3EKF3303V)
R48  Resistance: 10KΩ  [0603]  (hidden comment: RNCP0603FTD10K0)
R49  Resistance: 10Ω  [0603]  (hidden comment: RMCF0603JT10R0)
R50  Resistance: 10KΩ  [0603]  (hidden comment: RNCP0603FTD10K0)
R51  Resistance: 5mΩ  [RES_LVT12_004-020_OHM]  (hidden comment: LVT12R0050FER)
R52  Resistance: 0Ω  [0603]  (hidden comment: AC0603FR-070RL)
R53  Resistance: 10Ω  [0603]  (hidden comment: RMCF0603JT10R0)
R54  Resistance: 10KΩ  [0603]  (hidden comment: RNCP0603FTD10K0)
R55  Resistance: 10KΩ  [0603]  (hidden comment: RNCP0603FTD10K0)
R56  Resistance: 330KΩ  [0603]  (hidden comment: ERJ3EKF3303V)
R57  Resistance: 330KΩ  [0603]  (hidden comment: ERJ3EKF3303V)
R58  Resistance: 330KΩ  [0603]  (hidden comment: ERJ3EKF3303V)
R59  Resistance: 10KΩ  [0603]  (hidden comment: RNCP0603FTD10K0)
R60  Resistance: 10Ω  [0603]  (hidden comment: RMCF0603JT10R0)
R61  Resistance: 10KΩ  [0603]  (hidden comment: RNCP0603FTD10K0)
R62  Resistance: 330KΩ  [0603]  (hidden comment: ERJ3EKF3303V)
U9  MC33272ADR2G  [ONSC-SOIC-8-751-07_V]  (parts A,B of 2)
U10  MC33272ADR2G  [ONSC-SOIC-8-751-07_V]  (parts A,B of 2)
U11  MC33272ADR2G  [ONSC-SOIC-8-751-07_V]  (parts A,B of 2)

### Ports
3V3 (in), ADC1 (out), ADC2 (out), ADC4 (out), ADC5 (out), ADC7 (out), ADC8 (out), V3 (bidir), V4 (bidir)

### Nets
GND: R41.1 R44.1 R50.1
GND_AD: C29.1 C30.2 C32.2 C33.2 C34.1 C35.1 C36.2 C38.2 C40.2 C41.2 C42.2 C43.1 C44.2 C45.1 C48.2 C49.2 C50.2 C51.2 C52.1 C54.2 C55.2 R32.1 R43.1 R45.1 R56.1 R57.1 R62.1 U9.4(VEE) U10.4(VEE) U11.4(VEE)
GND_P: R30.1 R31.1 R35.1 R39.1 R41.2 R54.1
3V3: C30.1 C36.1 C44.1 U9.8(VCC) U10.8(VCC) U11.8(VCC) ; port 3V3
ADC1: C49.1 R49.2 ; port ADC1
ADC2: C55.1 R60.2 ; port ADC2
ADC4: C33.1 R29.2 ; port ADC4
ADC5: C40.1 R36.2 ; port ADC5
ADC7: C42.1 R40.2 ; port ADC7
ADC8: C51.1 R53.2 ; port ADC8
V3: R48.1 R51.2 R61.1 ; port V3
V4: R28.1 R30.2 R37.1 R51.1 R55.1 R59.1 ; port V4
NetC29_2: C29.2 C31.1 R27.1 R28.2 U9.2(IN1-)
NetC31_2: C31.2 C32.1 R31.2 R32.2 U9.3(IN1+)
NetC34_2: C34.2 C37.1 R33.1 R35.2 U9.6(IN2-)
NetC35_2: C35.2 C39.1 R34.1 R39.2 U10.2(IN1-)
NetC37_2: C37.2 C38.1 R38.2 R43.2 U9.5(IN2+)
NetC39_2: C39.2 C41.1 R42.2 R45.2 U10.3(IN1+)
NetC43_2: C43.2 C46.1 R46.1 R48.2 U11.2(IN1-)
NetC45_2: C45.2 C47.1 R47.1 R50.2 U10.6(IN2-)
NetC46_2: C46.2 C48.1 R52.2 R56.2 U11.3(IN1+)
NetC47_2: C47.2 C50.1 R54.2 R57.2 U10.5(IN2+)
NetC52_2: C52.2 C53.1 R58.1 R59.2 U11.6(IN2-)
NetC53_2: C53.2 C54.1 R61.2 R62.2 U11.5(IN2+)
NetR27_2: R27.2 R29.1 U9.1(OUT1)
NetR33_2: R33.2 R36.1 U9.7(OUT2)
NetR34_2: R34.2 R40.1 U10.1(OUT1)
NetR37_2: R37.2 R38.1
NetR42_1: R42.1 R44.2
NetR46_2: R46.2 R49.1 U11.1(OUT1)
NetR47_2: R47.2 R53.1 U10.7(OUT2)
NetR52_1: R52.1 R55.2
NetR58_2: R58.2 R60.1 U11.7(OUT2)

### Notes on the sheet
- Current Sensing
- JUMPER
- (near R55) JUMPER
- Modular Power Converter - Current Sensing
- 2
- Anastasiya Rybitska

### Library data of the parts
C30 C36 C44 = CL10B105KA8NFNC: as C2 on sheet Sheet3
C33 C40 C42 C49 C51 C55 = CC0603MRX7R8BB104: CAP CER 0.1UF 25V X7R 0603
R28 R31 R35 R37 R39 R44 R48 R50 R54 R55 R59 R61 = RNCP0603FTD10K0: 10kΩ ±1% 0.125W 0603 High Power Anti-Sulfur Thin Film Chip Resistor
R29 R36 R40 R49 R53 R60 = RMCF0603JT10R0: RES 10 OHM 5% 1/10W 0603
R30 R41 R51 = LVT12R0050FER: No Description Available; Mfr_Name: Ohmite; Copyright: Copyright (C) 2022 Ultra Librarian. All rights reserved.; Manufacturer_Part_Number: LVT12R0050FER; Digi-Key_Part_Number_1: LVT12R0050FERTR-ND; Digi-Key_Part_Number_2: LVT12R0050FERCT-ND; Digi-Key_Part_Number_3: LVT12R0050FERDKR-ND; RefDes: RefDes; Type: DEV
R38 R42 R52 = AC0603FR-070RL: RES SMD 0 OHM JUMPER 1/10W 0603
U9-U11 = CMP-1310-00346-1: Single Supply, High Slew Rate, Low Input Offset Voltage Operational Amplifier, 3 to 36 V, -40 to 85 degC, 8-Pin SOIC, Pb-Free, Tape and Reel; Manufacturer: On Semiconductor; VCC Min (V): 3; SR Typ (V/uS): 10; GBW Typ (MHz): 24; VCC Max (V): 36; ComponentLink2Description: Datasheet; Mounting Technology: Surface Mount; PackageDescription: 8-Pin Small Outline Integrated Circuit, Body 4.9 x 3.9 mm, Pitch 1.27 mm; ComponentLink1URL: http://www.onsemi.com/; PartNumber: MC33272ADR2G; Packing: Tape and Reel; RoHS: TRUE; ComponentLink2URL: http://www.onsemi.cn/pub_link/Collateral/MC33272A-D.PDF; DatasheetVersion: Rev. 14; ComponentLink3Description: Package Specification; ComponentLink3URL: http://www.onsemi.com/pub_link/Collateral/751-07.PDF; ComponentLink1Description: Manufacturer URL; PackageReference: SOIC-8-751-07; PackageVersion: Rev. AK, 02/2011

## Sheet Sheet6.SchDoc
size A4; SheetNumber: 6; SheetTotal: 6
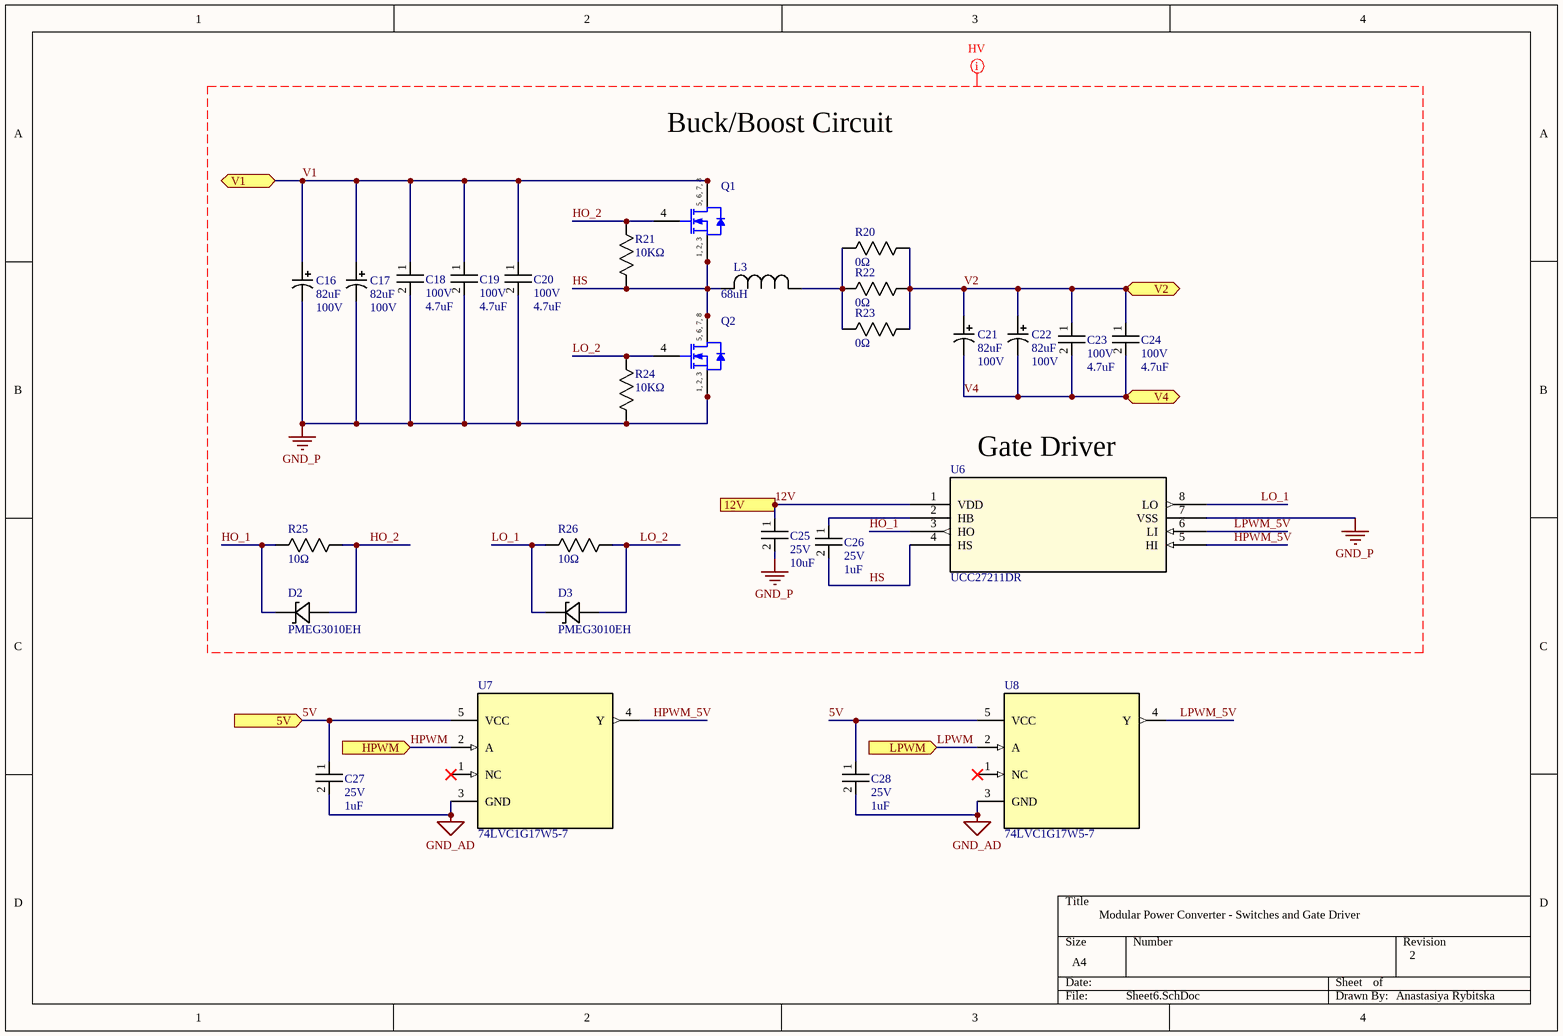
[diagram p5: Sheet6.SchDoc]

### Parts
C16  Capacitance: 82uF  Voltage Rating: 100V  [CAP_YX_10X16_RUB]  (hidden comment: 100ZLJ82M10X16)
C17  Capacitance: 82uF  Voltage Rating: 100V  [CAP_YX_10X16_RUB]  (hidden comment: 100ZLJ82M10X16)
C18  Voltage Rating: 100V  Capacitance: 4.7uF  [0805]  (hidden comment: C2012X5R2A475K125AC)
C19  Voltage Rating: 100V  Capacitance: 4.7uF  [0805]  (hidden comment: C2012X5R2A475K125AC)
C20  Voltage Rating: 100V  Capacitance: 4.7uF  [0805]  (hidden comment: C2012X5R2A475K125AC)
C21  Capacitance: 82uF  Voltage Rating: 100V  [CAP_YX_10X16_RUB]  (hidden comment: 100ZLJ82M10X16)
C22  Capacitance: 82uF  Voltage Rating: 100V  [CAP_YX_10X16_RUB]  (hidden comment: 100ZLJ82M10X16)
C23  Voltage Rating: 100V  Capacitance: 4.7uF  [0805]  (hidden comment: GRM21BD72A225ME01L)
C24  Voltage Rating: 100V  Capacitance: 4.7uF  [0805]  (hidden comment: GRM21BD72A225ME01L)
C25  Voltage Rating: 25V  Capacitance: 10uF  [0805]  (hidden comment: TMK212BBJ106KG-T)
C26  Voltage Rating: 25V  Capacitance: 1uF  [0603]  (hidden comment: CL10B105KA8NFNC)
C27  Voltage Rating: 25V  Capacitance: 1uF  [0603]  (hidden comment: CL10B105KA8NFNC)
C28  Voltage Rating: 25V  Capacitance: 1uF  [0603]  (hidden comment: CL10B105KA8NFNC)
D2  PMEG3010EH  [SOD123F_NXP]
D3  PMEG3010EH  [SOD123F_NXP]
L3  Inductance: 68uH  [IND_PA4349.683ANLT_PUL]  (hidden comment: PA4349.683ANLT)
Q1  TPH9R00CQH,LQ  [INF-PG-TDSON-8-1_V]  (value not drawn)
Q2  TPH9R00CQH,LQ  [INF-PG-TDSON-8-1_V]  (value not drawn)
R20  Resistance: 0Ω  [0603]  (hidden comment: AC0603FR-070RL)
R21  Resistance: 10KΩ  [0603]  (hidden comment: RNCP0603FTD10K0)
R22  Resistance: 0Ω  [0603]  (hidden comment: AC0603FR-070RL)
R23  Resistance: 0Ω  [0603]  (hidden comment: AC0603FR-070RL)
R24  Resistance: 10KΩ  [0603]  (hidden comment: RNCP0603FTD10K0)
R25  Resistance: 10Ω  [0603]  (hidden comment: RMCF0603JT10R0)
R26  Resistance: 10Ω  [0603]  (hidden comment: RMCF0603JT10R0)
U6  UCC27211DR  [D8]
U7  74LVC1G17W5-7  [SOT95P280X145-5N]
U8  74LVC1G17W5-7  [SOT95P280X145-5N]

### Ports
5V (in), 12V (in), HPWM (in), LPWM (in), V1 (bidir), V2 (bidir), V4 (bidir)

### Nets
GND_AD: C27.2 C28.2 U7.3(GND) U8.3(GND)
GND_P: C16.2 C17.2 C18.2 C19.2 C20.2 C25.2 Q2.1(SOURCE) Q2.2(SOURCE) Q2.3(SOURCE) R24.1 U6.7(VSS)
5V: C27.1 C28.1 U7.5(VCC) U8.5(VCC) ; port 5V
12V: C25.1 U6.1(VDD) ; port 12V
HO_1: D2.1 R25.1 U6.3(HO)
HO_2: D2.2 Q1.4(GATE) R21.2 R25.2
HPWM: U7.2(A) ; port HPWM
HPWM_5V: U6.5(HI) U7.4(Y)
HS: C26.2 L3.2 Q1.1(SOURCE) Q1.2(SOURCE) Q1.3(SOURCE) Q2.5(DRAIN) Q2.6(DRAIN) Q2.7(DRAIN) Q2.8(DRAIN) R21.1 U6.4(HS)
LO_1: D3.1 R26.1 U6.8(LO)
LO_2: D3.2 Q2.4(GATE) R24.2 R26.2
LPWM: U8.2(A) ; port LPWM
LPWM_5V: U6.6(LI) U8.4(Y)
V1: C16.1 C17.1 C18.1 C19.1 C20.1 Q1.5(DRAIN) Q1.6(DRAIN) Q1.7(DRAIN) Q1.8(DRAIN) ; port V1
V2: C21.1 C22.1 C23.1 C24.1 R20.2 R22.2 R23.2 ; port V2
V4: C21.2 C22.2 C23.2 C24.2 ; port V4
NetC26_1: C26.1 U6.2(HB)
NetL3_1: L3.1 R20.1 R22.1 R23.1

Not connected (* = marked no-connect by the designer): U7 1(NC)*; U8 1(NC)*

### Layout directives
rule Clearance Constraint [Clearance = 0.6mm]: 12V, GND_P, HO_1, HO_2, HPWM_5V, HS, LO_1, LO_2, LPWM_5V, V1, V2, V4

### Notes on the sheet
- Buck/Boost Circuit
- (near U6) Gate Driver
- Modular Power Converter - Switches and Gate Driver
- 2
- Anastasiya Rybitska
- (in symbol CMP-1091-00070-1) 5, 6, 7, 8; 1, 2, 3

### Library data of the parts
C16 C17 C21 C22 = 100ZLJ82M10X16: No Description Available; Mfr_Name: Rubycon; Type: DEV; Copyright: Copyright (C) 2022 Ultra Librarian. All rights reserved.; Manufacturer_Part_Number: 100ZLJ82M10X16; Digi-Key_Part_Number_1: 1189-1049-ND; RefDes: RefDes
C18-C20 = GRM21BD72A225ME01L: CAP CER 4.7UF 100V X5R 0805
C23 C24 = GRM21BD72A225ME01L: CAP CER 2.2UF 100V X7T 0805
C25 = TMK212BBJ106KG-T: as C9 on sheet Sheet4
C26-C28 = CL10B105KA8NFNC: as C2 on sheet Sheet3
D2 D3 = PMEG3010EH: No Description Available; Mfr_Name: NXP; Type: DEV; Copyright: Copyright (C) 2022 Ultra Librarian. All rights reserved.; Manufacturer_Part_Number: PMEG3010EH; Digi-Key_Part_Number_1: 568-4125-2-ND; Digi-Key_Part_Number_2: 568-4125-1-ND; Digi-Key_Part_Number_3: 568-4125-6-ND; RefDes: RefDes
L3 = PA4349.683ANLT: No Description Available; Mfr_Name: Pulse Electronics Corporation; Copyright: Copyright (C) 2022 Ultra Librarian. All rights reserved.; Manufacturer_Part_Number: PA4349.683ANLT
Q1 Q2 = CMP-1091-00070-1: N-Channel 150 V 64A (Tc) 960mW (Ta), 210W (Tc) Surface Mount 8-SOP Advance (5x5); Manufacturer: Infineon; PartNumber: BSC240N12NS3 G; IDpuls (max): 148Â A; RDS (on) (max): 24Â mOhm; VGS(th) (min): 2Â V; RthJA (max): 50Â K/W; Green: TRUE; RthJC (max): 1.9 K/W; Ptot (max): 66Â W; VDS (max): 120Â V; Polarity: N; QG: 20Â nC; VGS(th) (max): 4Â V; ID (max): 37Â A; Packing: Reel; Rth: 1.9Â K/W; ComponentLink3Description: Package Specification; ComponentLink2Description: Datasheet; Halogen-free: TRUE; PackageDescription: 8-Pin Plastic (Green) Thin Dual Small Outline Non-Leaded Package, 5.15 x 5.9 mm Body, 1.27 mm Pitch; DatasheetVersion: Rev. 2.0; ComponentLink2URL: http://www.infineon.com/dgdl/BSC240N12NS3+Rev2.pdf?folderId=db3a304313b8b5a60113cee8763b02d7&fileId=db3a30432a40a650012a42e6a9060027; ComponentLink3URL: http://www.infineon.com/cms/packages/SMD_-_Surface_Mounted_Devices/P-PG-TDSON/P-PG-TDSON-08-01x_2x_3.html?__locale=en; Mounting Technology: Surface Mount; ComponentLink1Description: Manufacturer URL; PackageReference: PG-TDSON-8-1; ComponentLink1URL: http://www.infineon.com/
R20 R22 R23 = AC0603FR-070RL: RES SMD 0 OHM JUMPER 1/10W 0603
R21 R24 = RNCP0603FTD10K0: as R28 on sheet Sheet5
R25 R26 = RMCF0603JT10R0: RES 10 OHM 5% 1/10W 0603
U6 = UCC27210D: IC GATE DRVR HALF-BRIDGE 8SOIC; Mfr_Name: Texas Instruments; Copyright: Copyright (C) 2022 Ultra Librarian. All rights reserved.; Manufacturer_Part_Number: UCC27210D; Digi-Key_Part_Number_1: 296-30015-5-ND; Digi-Key_Part_Number_2: 2156-UCC27210D-ND; RefDes: RefDes; Type: DEV
U7 U8 = 74LVC1G17W5-7: Buffer, Non-Inverting 1 Element 1 Bit per Element Push-Pull Output SOT-25; MF: Diodes Inc.; Digi-Key_Part_Number: 74LVC1G17W5-7CT-ND; Mouser-Purchase-URL: https://snapeda.com/shop?store=Mouser&id=277150; MP: 74LVC1G17W5-7; DigiKey-Purchase-URL: https://snapeda.com/shop?store=DigiKey&id=277150; Package: SOT-753 Diodes Inc.; SnapEDA_Link: https://www.snapeda.com/parts/74LVC1G17W5-7/Diodes%20Inc./view-part/277150/?ref=snap; Value: *

## Nets that join several sheets
GND: Sheet2 (J5.1 J5.2 J5.3 J5.4), Sheet5 (R41.1 R44.1 R50.1)
GND_AD: Sheet2 (J1.04 J4.2 J4.3 J7.02), Sheet3 (10 pins), Sheet4 (12 pins), Sheet5 (30 pins), Sheet6 (C27.2 C28.2 U7.3 U8.3)
GND_P: Sheet3 (R3.1), Sheet4 (R19.2), Sheet5 (6 pins), Sheet6 (11 pins)
3V3: Sheet3 (C2.1 C5.1 U1.8 U2.8), Sheet4 (C14.1 L2.2 U5.4), Sheet5 (6 pins)
3V3_D: Sheet2 (J1.01), Sheet4 (C15.1 L2.1)
5V: Sheet4 (6 pins), Sheet6 (C27.1 C28.1 U7.5 U8.5)
12V: Sheet4 (C11.1 U4.TAB), Sheet6 (C25.1 U6.1)
15V: Sheet2 (D1.2), Sheet4 (5 pins)
ADC1: Sheet2 (J1.06), Sheet5 (C49.1 R49.2)
ADC2: Sheet2 (J1.08), Sheet5 (C55.1 R60.2)
ADC3: Sheet2 (J1.10), Sheet3 (C6.1 R15.2)
ADC4: Sheet2 (J1.12), Sheet5 (C33.1 R29.2)
ADC5: Sheet2 (J1.14), Sheet5 (C40.1 R36.2)
ADC6: Sheet2 (J1.16), Sheet3 (C3.1 R6.2)
ADC7: Sheet2 (J1.18), Sheet5 (C42.1 R40.2)
ADC8: Sheet2 (J1.20), Sheet5 (C51.1 R53.2)
HPWM: Sheet2 (HI1.1 HI2.1), Sheet6 (U7.2)
LPWM: Sheet2 (LO1.1 LO2.1), Sheet6 (U8.2)
V1: Sheet2 (J2.1 J2.2 J2.3 J2.4), Sheet3 (R7.1), Sheet6 (9 pins)
V2: Sheet2 (J3.1 J3.2 J3.3 J3.4), Sheet3 (R16.1), Sheet6 (7 pins)
V3: Sheet2 (J6.1 J6.2 J6.3 J6.4), Sheet5 (R48.1 R51.2 R61.1)
V4: Sheet3 (R12.1), Sheet5 (6 pins), Sheet6 (C21.2 C22.2 C23.2 C24.2)